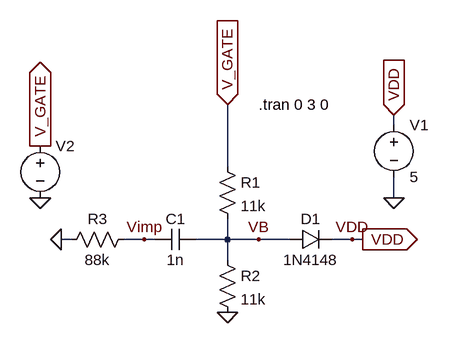
[diagram p0: schematic adaptateur_mono.asc]
adaptateur_mono.asc, the LTspice schematic file:
Version 4
SHEET 1 880 680
WIRE 224 128 224 112
WIRE -32 192 -32 96
WIRE 224 240 224 208
WIRE -272 304 -288 304
WIRE -160 304 -192 304
WIRE -144 304 -160 304
WIRE -32 304 -32 272
WIRE -32 304 -80 304
WIRE 16 304 -32 304
WIRE 64 304 16 304
WIRE 160 304 128 304
WIRE 176 304 160 304
WIRE -32 336 -32 304
FLAG -32 416 0
FLAG 160 304 VDD
FLAG 16 304 VB
FLAG 224 240 0
FLAG 224 112 VDD
IOPIN 224 112 In
FLAG 176 304 VDD
IOPIN 176 304 Out
FLAG -288 304 0
FLAG -160 304 Vimp
FLAG -320 240 0
FLAG -320 160 V_GATE
IOPIN -320 160 Out
FLAG -32 96 V_GATE
IOPIN -32 96 In
SYMBOL res -48 176 R0
SYMATTR InstName R1
SYMATTR Value 11k
SYMBOL res -48 320 R0
SYMATTR InstName R2
SYMATTR Value 11k
SYMBOL diode 64 320 R270
WINDOW 0 32 32 VTop 2
WINDOW 3 0 32 VBottom 2
SYMATTR InstName D1
SYMATTR Value 1N4148
SYMBOL voltage 224 112 R0
WINDOW 123 0 0 Left 0
WINDOW 39 0 0 Left 0
SYMATTR InstName V1
SYMATTR Value 5
SYMBOL cap -80 288 R90
WINDOW 0 0 32 VBottom 2
WINDOW 3 32 32 VTop 2
SYMATTR InstName C1
SYMATTR Value 1n
SYMBOL res -176 288 R90
WINDOW 0 0 56 VBottom 2
WINDOW 3 32 56 VTop 2
SYMATTR InstName R3
SYMATTR Value 88k
SYMBOL voltage -320 144 R0
WINDOW 3 -60 168 Invisible 2
WINDOW 123 0 0 Left 2
SYMATTR Value PWL(0 0 0.1 0 0.10000001 12 1.2 12 1.20000001 0 1.79999999 0 1.8 12 1.8999999 12 1.9 0 1.91 0 1.9111111 12)
SYMATTR SpiceLine Rser=50
SYMATTR InstName V2
TEXT 16 96 Left 2 !.tran 0 3 0

The netlist it stands for:
* adaptateur_mono.asc
R1 V_GATE VB 11k
R2 VB 0 11k
D1 VB VDD 1N4148
V1 VDD 0 5
C1 VB Vimp 1n
R3 Vimp 0 88k
V2 V_GATE 0 PWL(0 0 0.1 0 0.10000001 12 1.2 12 1.20000001 0 1.79999999 0 1.8 12 1.8999999 12 1.9 0 1.91 0 1.9111111 12) Rser=50
.model D D
.lib standard.dio
.tran 0 3 0
.backanno
.end